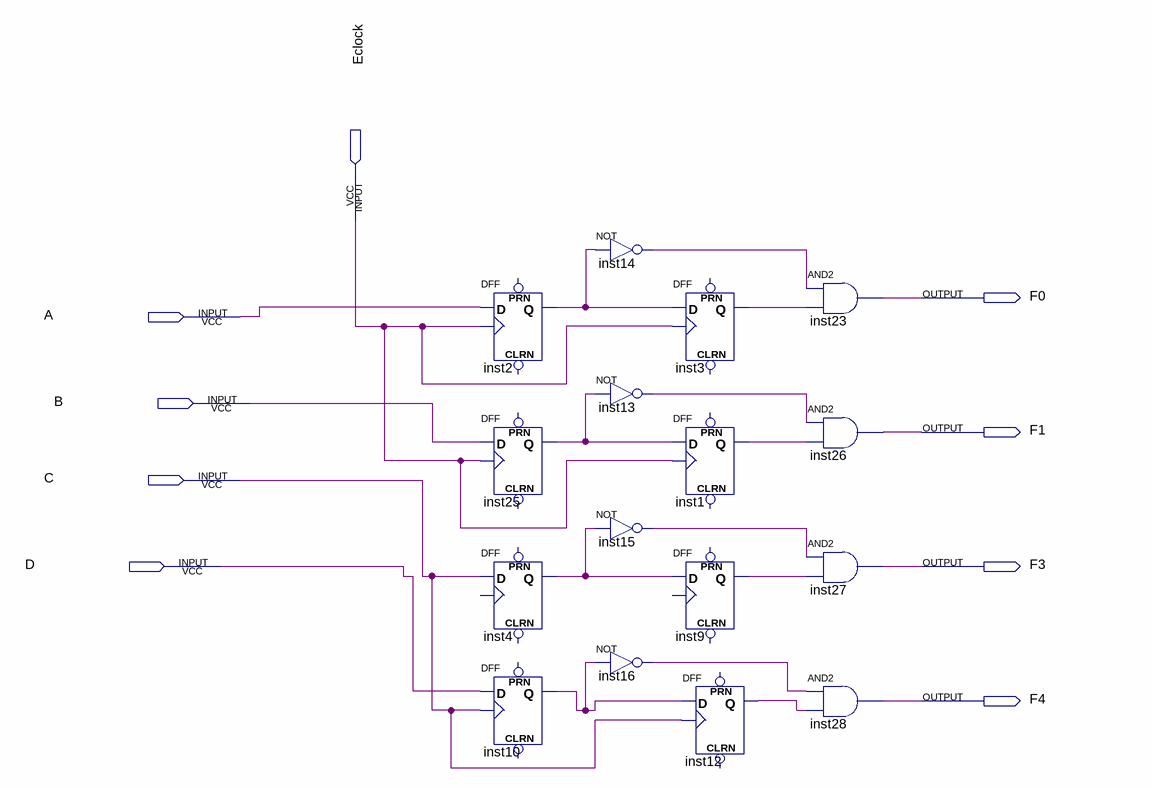
[diagram p0: schematic sheet]
// Quartus schematic Lab.bdf as structural Verilog: 16 symbols, 9 pins
module Lab (
  input  Eclock,
  input  A,
  input  B,
  input  C,
  input  D,
  output F0,
  output F1,
  output F3,
  output F4
);

  wire inst1_q, inst2_q, inst3_q, inst4_q, inst9_q, inst10_q, inst12_q, inst13_out, inst14_out, inst15_out,
       inst16_out, inst25_q;

  DFF inst2 (.CLK(Eclock), .D(A), .Q(inst2_q));  // open: CLRN, PRN
  DFF inst25 (.CLK(Eclock), .D(B), .Q(inst25_q));  // open: CLRN, PRN
  DFF inst4 (.D(C), .Q(inst4_q));  // open: CLRN, CLK, PRN
  DFF inst10 (.CLK(C), .D(D), .Q(inst10_q));  // open: CLRN, PRN
  not inst14 (inst14_out, inst2_q);
  not inst13 (inst13_out, inst25_q);
  not inst15 (inst15_out, inst4_q);
  not inst16 (inst16_out, inst10_q);
  DFF inst3 (.CLK(Eclock), .D(inst2_q), .Q(inst3_q));  // open: CLRN, PRN
  DFF inst1 (.CLK(Eclock), .D(inst25_q), .Q(inst1_q));  // open: CLRN, PRN
  DFF inst9 (.D(inst4_q), .Q(inst9_q));  // open: CLRN, CLK, PRN
  DFF inst12 (.CLK(C), .D(inst10_q), .Q(inst12_q));  // open: CLRN, PRN
  and inst23 (F0, inst14_out, inst3_q);
  and inst26 (F1, inst13_out, inst1_q);
  and inst27 (F3, inst15_out, inst9_q);
  and inst28 (F4, inst16_out, inst12_q);
endmodule
